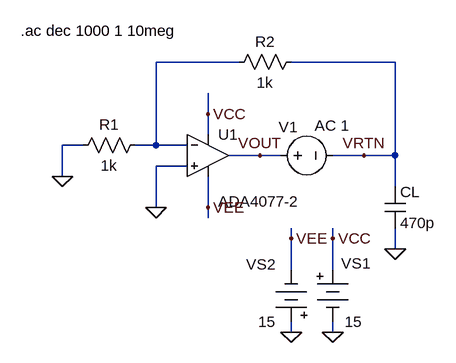
[diagram p0: schematic fig-03-01-24.asc]
fig-03-01-24.asc, the LTspice schematic file:
Version 4
SHEET 1 880 680
WIRE 256 32 128 32
WIRE 496 32 336 32
WIRE 208 112 208 80
WIRE 208 144 208 112
WIRE 16 160 -16 160
WIRE 128 160 128 32
WIRE 128 160 96 160
WIRE 176 160 128 160
WIRE 288 176 240 176
WIRE 320 176 288 176
WIRE 448 176 400 176
WIRE 496 176 496 32
WIRE 496 176 448 176
WIRE 176 192 128 192
WIRE -16 208 -16 160
WIRE 496 224 496 176
WIRE 128 256 128 192
WIRE 208 256 208 208
WIRE 208 272 208 256
WIRE 336 304 336 288
WIRE 400 304 400 288
WIRE 496 320 496 288
WIRE 336 352 336 304
WIRE 400 352 400 304
WIRE 336 448 336 432
WIRE 400 448 400 432
FLAG 128 256 0
FLAG -16 208 0
FLAG 336 448 0
FLAG 400 448 0
FLAG 336 304 VEE
FLAG 400 304 VCC
FLAG 208 112 VCC
FLAG 208 256 VEE
FLAG 496 320 0
FLAG 288 176 VOUT
FLAG 448 176 VRTN
SYMBOL res 352 16 R90
WINDOW 0 0 56 VBottom 2
WINDOW 3 32 56 VTop 2
SYMATTR InstName R2
SYMATTR Value 1k
SYMBOL Misc\\battery 400 336 R0
WINDOW 0 13 6 Left 2
WINDOW 3 18 96 Left 2
SYMATTR InstName VS1
SYMATTR Value 15
SYMBOL Misc\\battery 336 448 R180
WINDOW 0 24 104 Left 2
WINDOW 3 24 16 Left 2
SYMATTR InstName VS2
SYMATTR Value 15
SYMBOL Opamps\\ADA4077-2 208 112 R0
WINDOW 3 16 135 Left 2
SYMATTR InstName U1
SYMBOL res 112 144 R90
WINDOW 0 0 56 VBottom 2
WINDOW 3 32 56 VTop 2
SYMATTR InstName R1
SYMATTR Value 1k
SYMBOL voltage 304 176 R270
WINDOW 3 -77 115 Left 2
WINDOW 123 46 68 VRight 2
WINDOW 39 0 0 Left 0
WINDOW 0 44 13 VRight 2
SYMATTR Value ""
SYMATTR Value2 AC 1
SYMATTR InstName V1
SYMBOL cap 480 224 R0
SYMATTR InstName CL
SYMATTR Value 470p
TEXT -80 -16 Left 2 !.ac dec 1000 1 10meg

The netlist it stands for:
* fig-03-01-24.asc
R2 VRTN N001 1k
VS1 VCC 0 15
VS2 0 VEE 15
XU1 0 N001 VCC VEE VOUT ADA4077-2  ; pins In+ In- V+ V- OUT
R1 N001 0 1k
V1 VOUT VRTN AC 1
CL VRTN 0 470p
.ac dec 1000 1 10meg
.backanno
.end